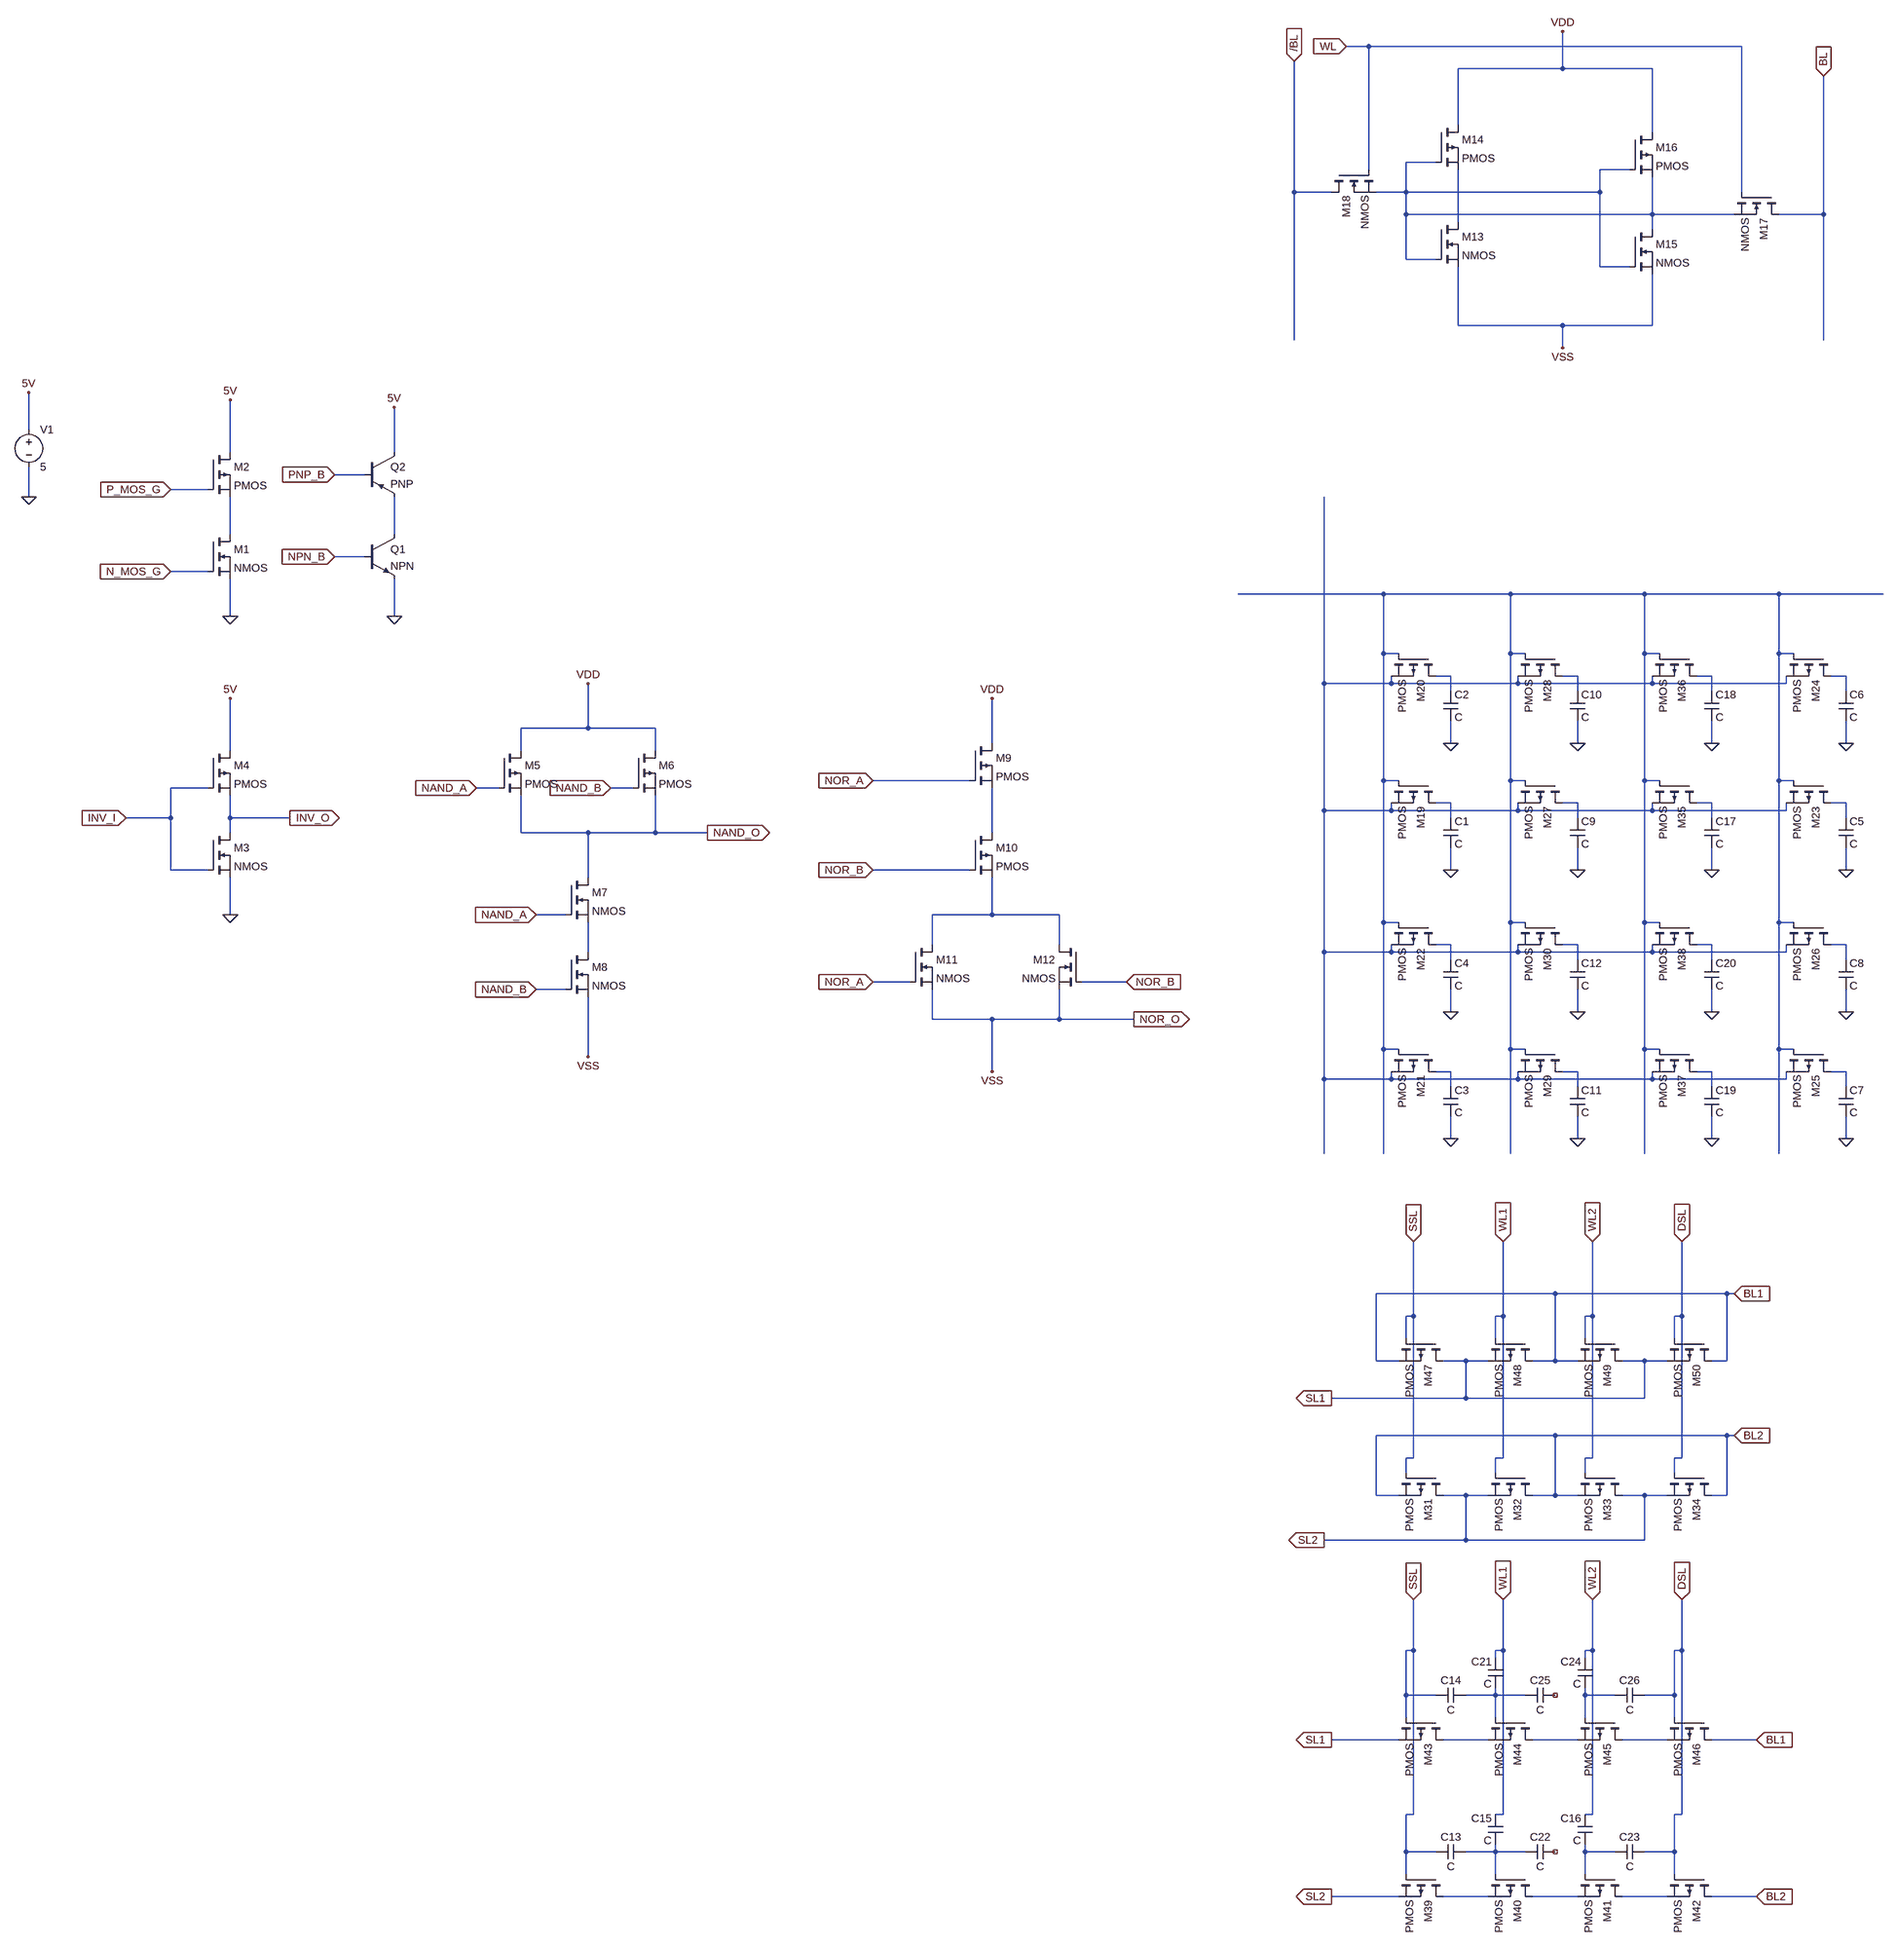
[diagram p0: schematic BJT_MOS_PARAM_Basic.asc]
BJT_MOS_PARAM_Basic.asc, the LTspice schematic file:
Version 4
SHEET 1 4024 2896
WIRE 2368 -1248 2320 -1248
WIRE 3168 -1248 2368 -1248
WIRE 2784 -1200 2784 -1280
WIRE 2784 -1200 2560 -1200
WIRE 2976 -1200 2784 -1200
WIRE 2560 -1056 2560 -1200
WIRE 2976 -1040 2976 -1200
WIRE 2512 -976 2448 -976
WIRE 2368 -960 2368 -1248
WIRE 2928 -960 2864 -960
WIRE 2208 -912 2208 -1216
WIRE 2288 -912 2208 -912
WIRE 2448 -912 2448 -976
WIRE 2448 -912 2384 -912
WIRE 2864 -912 2864 -960
WIRE 2864 -912 2448 -912
WIRE 3168 -912 3168 -1248
WIRE 2448 -864 2448 -912
WIRE 2976 -864 2976 -944
WIRE 2976 -864 2448 -864
WIRE 3152 -864 2976 -864
WIRE 3344 -864 3344 -1184
WIRE 3344 -864 3248 -864
WIRE 2560 -848 2560 -960
WIRE 2976 -832 2976 -864
WIRE 2448 -768 2448 -864
WIRE 2512 -768 2448 -768
WIRE 2864 -752 2864 -912
WIRE 2928 -752 2864 -752
WIRE 2560 -608 2560 -752
WIRE 2784 -608 2560 -608
WIRE 2976 -608 2976 -736
WIRE 2976 -608 2784 -608
WIRE 2208 -576 2208 -912
WIRE 3344 -576 3344 -864
WIRE 2784 -560 2784 -608
WIRE -912 -384 -912 -464
WIRE -480 -336 -480 -448
WIRE -128 -336 -128 -432
WIRE -192 -288 -256 -288
WIRE -528 -256 -608 -256
WIRE -912 -240 -912 -304
WIRE -480 -160 -480 -240
WIRE -128 -160 -128 -240
WIRE -192 -112 -256 -112
WIRE -528 -80 -608 -80
WIRE 2400 -32 2064 -32
WIRE 2672 -32 2400 -32
WIRE 2960 -32 2672 -32
WIRE 3248 -32 2960 -32
WIRE 3472 -32 3248 -32
WIRE -480 16 -480 -64
WIRE -128 16 -128 -64
WIRE 2400 96 2400 -32
WIRE 2432 96 2400 96
WIRE 2672 96 2672 -32
WIRE 2704 96 2672 96
WIRE 2960 96 2960 -32
WIRE 2992 96 2960 96
WIRE 3248 96 3248 -32
WIRE 3280 96 3248 96
WIRE 2544 144 2512 144
WIRE 2816 144 2784 144
WIRE 3104 144 3072 144
WIRE 3392 144 3360 144
WIRE 2272 160 2272 -240
WIRE 2416 160 2416 144
WIRE 2416 160 2272 160
WIRE 2688 160 2688 144
WIRE 2688 160 2416 160
WIRE 2976 160 2976 144
WIRE 2976 160 2688 160
WIRE 3264 160 3264 144
WIRE 3264 160 2976 160
WIRE 2544 176 2544 144
WIRE 2816 176 2816 144
WIRE 3104 176 3104 144
WIRE 3392 176 3392 144
WIRE 288 256 288 160
WIRE 288 256 144 256
WIRE 432 256 288 256
WIRE 1168 288 1168 192
WIRE 2544 288 2544 240
WIRE 2816 288 2816 240
WIRE 3104 288 3104 240
WIRE 3392 288 3392 240
WIRE -480 304 -480 192
WIRE 144 304 144 256
WIRE 432 304 432 256
WIRE 1120 368 912 368
WIRE 2400 368 2400 96
WIRE 2432 368 2400 368
WIRE 2672 368 2672 96
WIRE 2704 368 2672 368
WIRE 2960 368 2960 96
WIRE 2992 368 2960 368
WIRE 3248 368 3248 96
WIRE 3280 368 3248 368
WIRE -528 384 -608 384
WIRE 96 384 48 384
WIRE 384 384 336 384
WIRE 2544 416 2512 416
WIRE 2816 416 2784 416
WIRE 3104 416 3072 416
WIRE 3392 416 3360 416
WIRE 2272 432 2272 160
WIRE 2416 432 2416 416
WIRE 2416 432 2272 432
WIRE 2688 432 2688 416
WIRE 2688 432 2416 432
WIRE 2976 432 2976 416
WIRE 2976 432 2688 432
WIRE 3264 432 3264 416
WIRE 3264 432 2976 432
WIRE -608 448 -608 384
WIRE -608 448 -704 448
WIRE -480 448 -480 400
WIRE -352 448 -480 448
WIRE 2544 448 2544 416
WIRE 2816 448 2816 416
WIRE 3104 448 3104 416
WIRE 3392 448 3392 416
WIRE -480 480 -480 448
WIRE 144 480 144 400
WIRE 288 480 144 480
WIRE 432 480 432 400
WIRE 432 480 288 480
WIRE 544 480 432 480
WIRE 1168 480 1168 384
WIRE -608 560 -608 448
WIRE -528 560 -608 560
WIRE 1120 560 912 560
WIRE 2544 560 2544 512
WIRE 2816 560 2816 512
WIRE 3104 560 3104 512
WIRE 3392 560 3392 512
WIRE 288 576 288 480
WIRE -480 656 -480 576
WIRE 240 656 176 656
WIRE 1168 656 1168 576
WIRE 1168 656 1040 656
WIRE 1312 656 1168 656
WIRE 2400 672 2400 368
WIRE 2432 672 2400 672
WIRE 2672 672 2672 368
WIRE 2704 672 2672 672
WIRE 2960 672 2960 368
WIRE 2992 672 2960 672
WIRE 3248 672 3248 368
WIRE 3280 672 3248 672
WIRE 1040 720 1040 656
WIRE 1312 720 1312 656
WIRE 2544 720 2512 720
WIRE 2816 720 2784 720
WIRE 3104 720 3072 720
WIRE 3392 720 3360 720
WIRE 288 736 288 672
WIRE 2272 736 2272 432
WIRE 2416 736 2416 720
WIRE 2416 736 2272 736
WIRE 2688 736 2688 720
WIRE 2688 736 2416 736
WIRE 2976 736 2976 720
WIRE 2976 736 2688 736
WIRE 3264 736 3264 720
WIRE 3264 736 2976 736
WIRE 2544 752 2544 720
WIRE 2816 752 2816 720
WIRE 3104 752 3104 720
WIRE 3392 752 3392 720
WIRE 992 800 912 800
WIRE 1456 800 1360 800
WIRE 240 816 176 816
WIRE 2544 864 2544 816
WIRE 2816 864 2816 816
WIRE 3104 864 3104 816
WIRE 3392 864 3392 816
WIRE 1040 880 1040 816
WIRE 1168 880 1040 880
WIRE 1312 880 1312 816
WIRE 1312 880 1168 880
WIRE 1472 880 1312 880
WIRE 2400 944 2400 672
WIRE 2432 944 2400 944
WIRE 2672 944 2672 672
WIRE 2704 944 2672 944
WIRE 2960 944 2960 672
WIRE 2992 944 2960 944
WIRE 3248 944 3248 672
WIRE 3280 944 3248 944
WIRE 288 960 288 832
WIRE 1168 992 1168 880
WIRE 2544 992 2512 992
WIRE 2816 992 2784 992
WIRE 3104 992 3072 992
WIRE 3392 992 3360 992
WIRE 2272 1008 2272 736
WIRE 2416 1008 2416 992
WIRE 2416 1008 2272 1008
WIRE 2688 1008 2688 992
WIRE 2688 1008 2416 1008
WIRE 2976 1008 2976 992
WIRE 2976 1008 2688 1008
WIRE 3264 1008 3264 992
WIRE 3264 1008 2976 1008
WIRE 2544 1024 2544 992
WIRE 2816 1024 2816 992
WIRE 3104 1024 3104 992
WIRE 3392 1024 3392 992
WIRE 2544 1136 2544 1088
WIRE 2816 1136 2816 1088
WIRE 3104 1136 3104 1088
WIRE 3392 1136 3392 1088
WIRE 2272 1168 2272 1008
WIRE 2400 1168 2400 944
WIRE 2672 1168 2672 944
WIRE 2960 1168 2960 944
WIRE 3248 1168 3248 944
WIRE 2768 1520 2384 1520
WIRE 3136 1520 2768 1520
WIRE 3152 1520 3136 1520
WIRE 2464 1568 2464 1408
WIRE 2464 1568 2448 1568
WIRE 2656 1568 2656 1408
WIRE 2656 1568 2640 1568
WIRE 2848 1568 2848 1408
WIRE 2848 1568 2832 1568
WIRE 3040 1568 3040 1408
WIRE 3040 1568 3024 1568
WIRE 2448 1616 2448 1568
WIRE 2640 1616 2640 1568
WIRE 2832 1616 2832 1568
WIRE 3024 1616 3024 1568
WIRE 2384 1664 2384 1520
WIRE 2432 1664 2384 1664
WIRE 2576 1664 2528 1664
WIRE 2624 1664 2576 1664
WIRE 2768 1664 2768 1520
WIRE 2768 1664 2720 1664
WIRE 2816 1664 2768 1664
WIRE 2960 1664 2912 1664
WIRE 3008 1664 2960 1664
WIRE 3136 1664 3136 1520
WIRE 3136 1664 3104 1664
WIRE 2576 1744 2576 1664
WIRE 2576 1744 2288 1744
WIRE 2960 1744 2960 1664
WIRE 2960 1744 2576 1744
WIRE 2768 1824 2384 1824
WIRE 3136 1824 2768 1824
WIRE 3152 1824 3136 1824
WIRE 2464 1872 2464 1568
WIRE 2464 1872 2448 1872
WIRE 2656 1872 2656 1568
WIRE 2656 1872 2640 1872
WIRE 2848 1872 2848 1568
WIRE 2848 1872 2832 1872
WIRE 3040 1872 3040 1568
WIRE 3040 1872 3024 1872
WIRE 2448 1904 2448 1872
WIRE 2640 1904 2640 1872
WIRE 2832 1904 2832 1872
WIRE 3024 1904 3024 1872
WIRE 2384 1952 2384 1824
WIRE 2432 1952 2384 1952
WIRE 2576 1952 2528 1952
WIRE 2624 1952 2576 1952
WIRE 2768 1952 2768 1824
WIRE 2768 1952 2720 1952
WIRE 2816 1952 2768 1952
WIRE 2960 1952 2912 1952
WIRE 3008 1952 2960 1952
WIRE 3136 1952 3136 1824
WIRE 3136 1952 3104 1952
WIRE 2576 2048 2576 1952
WIRE 2576 2048 2272 2048
WIRE 2960 2048 2960 1952
WIRE 2960 2048 2576 2048
WIRE 2464 2288 2464 2176
WIRE 2464 2288 2448 2288
WIRE 2656 2288 2656 2176
WIRE 2656 2288 2640 2288
WIRE 2848 2288 2848 2176
WIRE 2848 2288 2832 2288
WIRE 3040 2288 3040 2176
WIRE 3040 2288 3024 2288
WIRE 2640 2304 2640 2288
WIRE 2832 2304 2832 2288
WIRE 2448 2384 2448 2288
WIRE 2512 2384 2448 2384
WIRE 2640 2384 2640 2368
WIRE 2640 2384 2576 2384
WIRE 2704 2384 2640 2384
WIRE 2832 2384 2832 2368
WIRE 2896 2384 2832 2384
WIRE 3024 2384 3024 2288
WIRE 3024 2384 2960 2384
WIRE 2448 2432 2448 2384
WIRE 2640 2432 2640 2384
WIRE 2832 2432 2832 2384
WIRE 3024 2432 3024 2384
WIRE 2432 2480 2288 2480
WIRE 2624 2480 2528 2480
WIRE 2816 2480 2720 2480
WIRE 3008 2480 2912 2480
WIRE 3200 2480 3104 2480
WIRE 2464 2640 2464 2288
WIRE 2464 2640 2448 2640
WIRE 2656 2640 2656 2288
WIRE 2656 2640 2640 2640
WIRE 2848 2640 2848 2288
WIRE 2848 2640 2832 2640
WIRE 3040 2640 3040 2288
WIRE 3040 2640 3024 2640
WIRE 2448 2720 2448 2640
WIRE 2512 2720 2448 2720
WIRE 2640 2720 2640 2704
WIRE 2640 2720 2576 2720
WIRE 2704 2720 2640 2720
WIRE 2832 2720 2832 2704
WIRE 2896 2720 2832 2720
WIRE 3024 2720 3024 2640
WIRE 3024 2720 2960 2720
WIRE 2448 2768 2448 2720
WIRE 2640 2768 2640 2720
WIRE 2832 2768 2832 2720
WIRE 3024 2768 3024 2720
WIRE 2432 2816 2288 2816
WIRE 2624 2816 2528 2816
WIRE 2816 2816 2720 2816
WIRE 3008 2816 2912 2816
WIRE 3200 2816 3104 2816
FLAG -480 16 0
FLAG -128 16 0
FLAG -912 -240 0
FLAG -912 -464 5V
FLAG -480 -448 5V
FLAG -128 -432 5V
FLAG -608 -256 P_MOS_G
IOPIN -608 -256 In
FLAG -608 -80 N_MOS_G
IOPIN -608 -80 In
FLAG -256 -288 PNP_B
IOPIN -256 -288 In
FLAG -256 -112 NPN_B
IOPIN -256 -112 In
FLAG -480 656 0
FLAG -480 192 5V
FLAG -704 448 INV_I
IOPIN -704 448 In
FLAG -352 448 INV_O
IOPIN -352 448 Out
FLAG 288 160 VDD
FLAG 288 960 VSS
FLAG 48 384 NAND_A
IOPIN 48 384 In
FLAG 544 480 NAND_O
IOPIN 544 480 Out
FLAG 336 384 NAND_B
IOPIN 336 384 In
FLAG 176 656 NAND_A
IOPIN 176 656 In
FLAG 176 816 NAND_B
IOPIN 176 816 In
FLAG 1168 992 VSS
FLAG 1168 192 VDD
FLAG 1472 880 NOR_O
IOPIN 1472 880 Out
FLAG 912 800 NOR_A
IOPIN 912 800 In
FLAG 912 368 NOR_A
IOPIN 912 368 In
FLAG 912 560 NOR_B
IOPIN 912 560 In
FLAG 1456 800 NOR_B
IOPIN 1456 800 In
FLAG 2208 -1216 /BL
IOPIN 2208 -1216 In
FLAG 3344 -1184 BL
IOPIN 3344 -1184 In
FLAG 2784 -560 VSS
FLAG 2784 -1280 VDD
FLAG 2320 -1248 WL
IOPIN 2320 -1248 In
FLAG 2544 560 0
FLAG 2544 288 0
FLAG 2544 1136 0
FLAG 2544 864 0
FLAG 3392 560 0
FLAG 3392 288 0
FLAG 3392 1136 0
FLAG 3392 864 0
FLAG 2816 560 0
FLAG 2816 288 0
FLAG 2816 1136 0
FLAG 2816 864 0
FLAG 3104 560 0
FLAG 3104 288 0
FLAG 3104 1136 0
FLAG 3104 864 0
FLAG 2464 2176 SSL
IOPIN 2464 2176 In
FLAG 2656 2176 WL1
IOPIN 2656 2176 In
FLAG 2848 2176 WL2
IOPIN 2848 2176 In
FLAG 3040 2176 DSL
IOPIN 3040 2176 In
FLAG 2288 2480 SL1
IOPIN 2288 2480 Out
FLAG 2288 2816 SL2
IOPIN 2288 2816 Out
FLAG 3200 2480 BL1
IOPIN 3200 2480 In
FLAG 3200 2816 BL2
IOPIN 3200 2816 In
FLAG 2464 1408 SSL
IOPIN 2464 1408 In
FLAG 2656 1408 WL1
IOPIN 2656 1408 In
FLAG 2848 1408 WL2
IOPIN 2848 1408 In
FLAG 3040 1408 DSL
IOPIN 3040 1408 In
FLAG 3152 1520 BL1
IOPIN 3152 1520 In
FLAG 3152 1824 BL2
IOPIN 3152 1824 In
FLAG 2288 1744 SL1
IOPIN 2288 1744 Out
FLAG 2272 2048 SL2
IOPIN 2272 2048 Out
SYMBOL nmos -528 -160 R0
SYMATTR InstName M1
SYMBOL pmos -528 -336 R0
SYMATTR InstName M2
SYMBOL npn -192 -160 R0
SYMATTR InstName Q1
SYMBOL pnp -192 -336 R0
SYMATTR InstName Q2
SYMBOL voltage -912 -400 R0
SYMATTR InstName V1
SYMATTR Value 5
SYMBOL nmos -528 480 R0
SYMATTR InstName M3
SYMBOL pmos -528 304 R0
SYMATTR InstName M4
SYMBOL pmos 96 304 R0
SYMATTR InstName M5
SYMBOL pmos 384 304 R0
SYMATTR InstName M6
SYMBOL nmos 240 576 R0
SYMATTR InstName M7
SYMBOL nmos 240 736 R0
SYMATTR InstName M8
SYMBOL pmos 1120 288 R0
SYMATTR InstName M9
SYMBOL pmos 1120 480 R0
SYMATTR InstName M10
SYMBOL nmos 992 720 R0
SYMATTR InstName M11
SYMBOL nmos 1360 720 M0
SYMATTR InstName M12
SYMBOL nmos 2512 -848 R0
SYMATTR InstName M13
SYMBOL pmos 2512 -1056 R0
SYMATTR InstName M14
SYMBOL nmos 2928 -832 R0
SYMATTR InstName M15
SYMBOL pmos 2928 -1040 R0
SYMATTR InstName M16
SYMBOL nmos 3248 -912 R90
SYMATTR InstName M17
SYMBOL nmos 2288 -960 M90
SYMATTR InstName M18
SYMBOL pmos 2512 368 R90
SYMATTR InstName M19
SYMBOL cap 2528 448 R0
SYMATTR InstName C1
SYMBOL pmos 2512 96 R90
SYMATTR InstName M20
SYMBOL cap 2528 176 R0
SYMATTR InstName C2
SYMBOL pmos 2512 944 R90
SYMATTR InstName M21
SYMBOL cap 2528 1024 R0
SYMATTR InstName C3
SYMBOL pmos 2512 672 R90
SYMATTR InstName M22
SYMBOL cap 2528 752 R0
SYMATTR InstName C4
SYMBOL pmos 3360 368 R90
SYMATTR InstName M23
SYMBOL cap 3376 448 R0
SYMATTR InstName C5
SYMBOL pmos 3360 96 R90
SYMATTR InstName M24
SYMBOL cap 3376 176 R0
SYMATTR InstName C6
SYMBOL pmos 3360 944 R90
SYMATTR InstName M25
SYMBOL cap 3376 1024 R0
SYMATTR InstName C7
SYMBOL pmos 3360 672 R90
SYMATTR InstName M26
SYMBOL cap 3376 752 R0
SYMATTR InstName C8
SYMBOL pmos 2784 368 R90
SYMATTR InstName M27
SYMBOL cap 2800 448 R0
SYMATTR InstName C9
SYMBOL pmos 2784 96 R90
SYMATTR InstName M28
SYMBOL cap 2800 176 R0
SYMATTR InstName C10
SYMBOL pmos 2784 944 R90
SYMATTR InstName M29
SYMBOL cap 2800 1024 R0
SYMATTR InstName C11
SYMBOL pmos 2784 672 R90
SYMATTR InstName M30
SYMBOL cap 2800 752 R0
SYMATTR InstName C12
SYMBOL pmos 3072 368 R90
SYMATTR InstName M35
SYMBOL cap 3088 448 R0
SYMATTR InstName C17
SYMBOL pmos 3072 96 R90
SYMATTR InstName M36
SYMBOL cap 3088 176 R0
SYMATTR InstName C18
SYMBOL pmos 3072 944 R90
SYMATTR InstName M37
SYMBOL cap 3088 1024 R0
SYMATTR InstName C19
SYMBOL pmos 3072 672 R90
SYMATTR InstName M38
SYMBOL cap 3088 752 R0
SYMATTR InstName C20
SYMBOL pmos 2528 1904 R90
SYMATTR InstName M31
SYMBOL pmos 2720 1904 R90
SYMATTR InstName M32
SYMBOL pmos 2912 1904 R90
SYMATTR InstName M33
SYMBOL pmos 3104 1904 R90
SYMATTR InstName M34
SYMBOL pmos 2528 2768 R90
SYMATTR InstName M39
SYMBOL pmos 2720 2768 R90
SYMATTR InstName M40
SYMBOL pmos 2912 2768 R90
SYMATTR InstName M41
SYMBOL pmos 3104 2768 R90
SYMATTR InstName M42
SYMBOL cap 2576 2704 R90
WINDOW 0 0 32 VBottom 2
WINDOW 3 32 32 VTop 2
SYMATTR InstName C13
SYMBOL cap 2656 2704 R180
WINDOW 0 24 56 Left 2
WINDOW 3 24 8 Left 2
SYMATTR InstName C15
SYMBOL cap 2848 2704 R180
WINDOW 0 24 56 Left 2
WINDOW 3 24 8 Left 2
SYMATTR InstName C16
SYMBOL cap 2768 2704 R90
WINDOW 0 0 32 VBottom 2
WINDOW 3 32 32 VTop 2
SYMATTR InstName C22
SYMBOL cap 2960 2704 R90
WINDOW 0 0 32 VBottom 2
WINDOW 3 32 32 VTop 2
SYMATTR InstName C23
SYMBOL pmos 2528 2432 R90
SYMATTR InstName M43
SYMBOL pmos 2720 2432 R90
SYMATTR InstName M44
SYMBOL pmos 2912 2432 R90
SYMATTR InstName M45
SYMBOL pmos 3104 2432 R90
SYMATTR InstName M46
SYMBOL cap 2576 2368 R90
WINDOW 0 0 32 VBottom 2
WINDOW 3 32 32 VTop 2
SYMATTR InstName C14
SYMBOL cap 2656 2368 R180
WINDOW 0 24 56 Left 2
WINDOW 3 24 8 Left 2
SYMATTR InstName C21
SYMBOL cap 2848 2368 R180
WINDOW 0 24 56 Left 2
WINDOW 3 24 8 Left 2
SYMATTR InstName C24
SYMBOL cap 2768 2368 R90
WINDOW 0 0 32 VBottom 2
WINDOW 3 32 32 VTop 2
SYMATTR InstName C25
SYMBOL cap 2960 2368 R90
WINDOW 0 0 32 VBottom 2
WINDOW 3 32 32 VTop 2
SYMATTR InstName C26
SYMBOL pmos 2528 1616 R90
SYMATTR InstName M47
SYMBOL pmos 2720 1616 R90
SYMATTR InstName M48
SYMBOL pmos 2912 1616 R90
SYMATTR InstName M49
SYMBOL pmos 3104 1616 R90
SYMATTR InstName M50

The netlist it stands for:
* BJT_MOS_PARAM_Basic.asc
M1 N003 N_MOS_G 0 0 NMOS
M2 5V P_MOS_G N003 N003 PMOS
Q1 N004 NPN_B 0 0 NPN
Q2 5V PNP_B N004 0 PNP
V1 5V 0 5
M3 INV_O INV_I 0 0 NMOS
M4 5V INV_I INV_O INV_O PMOS
M5 VDD NAND_A NAND_O NAND_O PMOS
M6 VDD NAND_B NAND_O NAND_O PMOS
M7 NAND_O NAND_A N021 N021 NMOS
M8 N021 NAND_B NOR_O NOR_O NMOS
M9 VDD NOR_A N015 N015 PMOS
M10 N015 NOR_B N016 N016 PMOS
M11 N016 NOR_A NOR_O NOR_O NMOS
M12 N016 NOR_B NOR_O NOR_O NMOS
M13 N002 N001 NOR_O NOR_O NMOS
M14 VDD N001 N002 N002 PMOS
M15 N001 N001 NOR_O NOR_O NMOS
M16 VDD N001 N001 N001 PMOS
M17 BL WL N001 N001 NMOS
M18 /BL WL N001 N001 NMOS
M19 N011 N005 N010 N010 PMOS
C1 N011 0 C
M20 N006 N005 N010 N010 PMOS
C2 N006 0 C
M21 N022 N005 N010 N010 PMOS
C3 N022 0 C
M22 N017 N005 N010 N010 PMOS
C4 N017 0 C
M23 N014 N005 N010 N010 PMOS
C5 N014 0 C
M24 N009 N005 N010 N010 PMOS
C6 N009 0 C
M25 N025 N005 N010 N010 PMOS
C7 N025 0 C
M26 N020 N005 N010 N010 PMOS
C8 N020 0 C
M27 N012 N005 N010 N010 PMOS
C9 N012 0 C
M28 N007 N005 N010 N010 PMOS
C10 N007 0 C
M29 N023 N005 N010 N010 PMOS
C11 N023 0 C
M30 N018 N005 N010 N010 PMOS
C12 N018 0 C
M35 N013 N005 N010 N010 PMOS
C17 N013 0 C
M36 N008 N005 N010 N010 PMOS
C18 N008 0 C
M37 N024 N005 N010 N010 PMOS
C19 N024 0 C
M38 N019 N005 N010 N010 PMOS
C20 N019 0 C
M31 SL2 SSL BL2 BL2 PMOS
M32 BL2 WL1 SL2 SL2 PMOS
M33 SL2 WL2 BL2 BL2 PMOS
M34 BL2 DSL SL2 SL2 PMOS
M39 N033 SSL SL2 SL2 PMOS
M40 N034 N031 N033 N033 PMOS
M41 N035 N032 N034 N034 PMOS
M42 BL2 DSL N035 N035 PMOS
C13 N031 SSL C
C15 N031 WL1 C
C16 N032 WL2 C
C22 NC_01 N031 C
C23 DSL N032 C
M43 N028 SSL SL1 SL1 PMOS
M44 N029 N026 N028 N028 PMOS
M45 N030 N027 N029 N029 PMOS
M46 BL1 DSL N030 N030 PMOS
C14 N026 SSL C
C21 N026 WL1 C
C24 N027 WL2 C
C25 NC_02 N026 C
C26 DSL N027 C
M47 SL1 SSL BL1 BL1 PMOS
M48 BL1 WL1 SL1 SL1 PMOS
M49 SL1 WL2 BL1 BL1 PMOS
M50 BL1 DSL SL1 SL1 PMOS
.model NPN NPN
.model PNP PNP
.lib standard.bjt
.model NMOS NMOS
.model PMOS PMOS
.lib standard.mos
.backanno
.end